# EasyEDA Pro project ProPrj_HSSM-Prog_2025-06-12.epro

# Schematic Schematic1
Board Name: Board1; Create Date: 2025-01-19; Page Name: P1; Project Name: HSSM-Prog; Schematic Name: Schematic1; Update Date: 2025-03-10; Company: EasyEDA.com; Page Size: A4; Version: V1.0
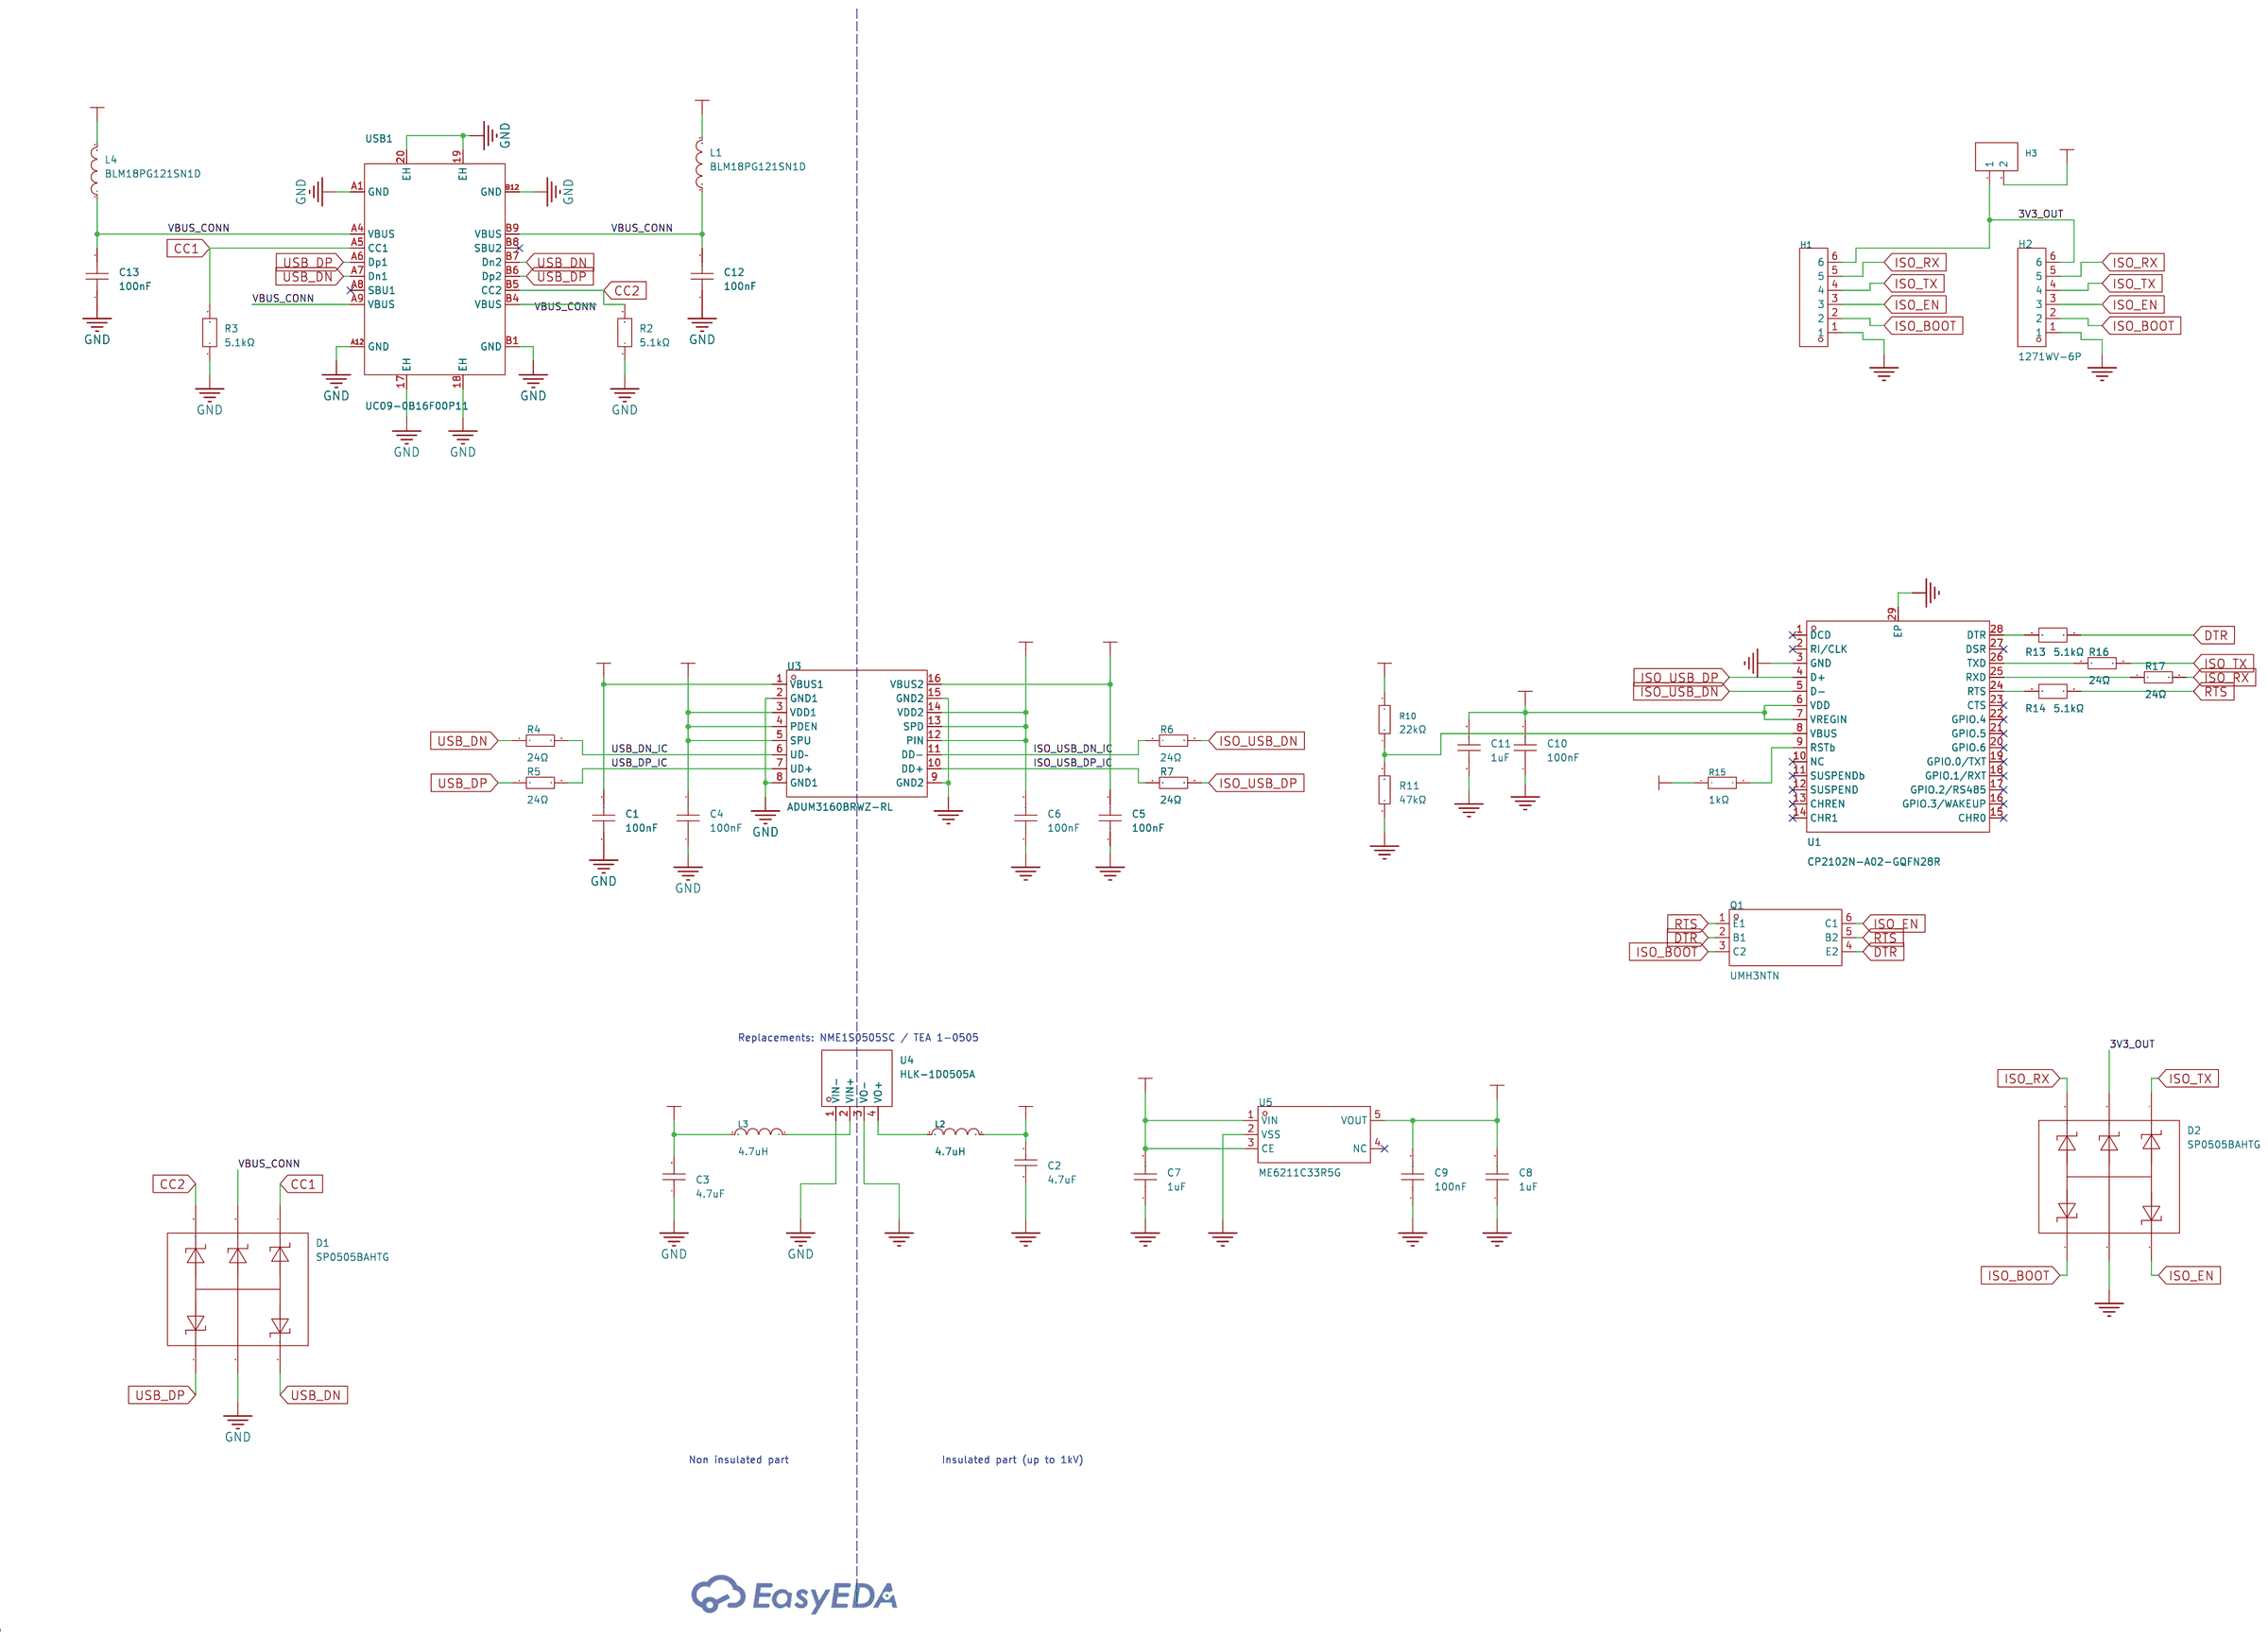
[diagram p0: schematic sheet]

## Parts
C1  100nF  [C0402]
C2  4.7uF  [C0603]
C3  4.7uF  [C0603]
C4  100nF  [C0402]
C5  100nF  [C0402]
C6  100nF  [C0402]
C7  1uF  [C0402]
C8  1uF  [C0402]
C9  100nF  [C0402]
C10  100nF  [C0402]
C11  1uF  [C0402]
C12  100nF  [C0402]
C13  100nF  [C0402]
D1  SP0505BAHTG  [SOT-23-6_L2.9-W1.6-P0.95-LS2.8-BR]
D2  SP0505BAHTG  [SOT-23-6_L2.9-W1.6-P0.95-LS2.8-BR]
H1  -  [HDR-TH_6P-P2.54-V-F]
H2  1271WV-6P  [HDR-TH_6P-P1.27-V-M-A]
H3  -  [HDR-TH_2P-P2.54-V-F]
L1  BLM18PG121SN1D  [L0603]
L2  4.7uH  [IND-SMD_L4.0-W4.0_SMNR4020]
L3  4.7uH  [IND-SMD_L4.0-W4.0_SMNR4020]
L4  BLM18PG121SN1D  [L0603]
Q1  UMH3NTN  [SOT-363_L2.0-W1.3-P0.65-LS2.1-TL]
R2  5.1kΩ  [R0402]
R3  5.1kΩ  [R0402]
R4  24Ω  [R0402]
R5  24Ω  [R0402]
R6  24Ω  [R0402]
R7  24Ω  [R0402]
R10  22kΩ  [R0402]
R11  47kΩ  [R0402]
R13  5.1kΩ  [R0402]
R14  5.1kΩ  [R0402]
R15  1kΩ  [R0402]
R16  24Ω  [R0402]
R17  24Ω  [R0402]
U1  CP2102N-A02-GQFN28R  [QFN-28_L5.0-W5.0-P0.50-TL-EP3.3]
U3  ADUM3160BRWZ-RL  [SOIC-16_L10.3-W7.5-P1.27-LS10.3-BL]
U4  HLK-1D0505A  [PWRM-TH_HLK-1DXXXX]
U5  ME6211C33R5G  [SOT-353_L2.1-W1.3-P0.65-LS2.3-BL]
USB1  UC09-0B16F00P11  [USB-C_UC09-0B16F00P11]

## Library data of the parts
C1 C4-C6 C9 C10 C12 C13 = CL05B104KO5NNNC: Capacitance: Tolerance:±10% Tolerance:±10% Voltage Rated: Temperature Coefficient:; LCSC Part Name: 100nF ±10% 16V; Supplier Part: C1525; Manufacturer: SAMSUNG(三星); Supplier Footprint: 0402; JLCPCB Part Class: Basic Part; Datasheet: https://atta.szlcsc.com/upload/public/pdf/source/20160218/1457707763339.pdf; Supplier: LCSC; Tolerance: ±10%
C2 C3 = CL10A475KO8NNNC: Capacitance: Tolerance:±10% Tolerance:±10% Voltage Rated: Temperature Coefficient:; LCSC Part Name: 4.7uF ±10% 16V; Supplier Part: C19666; Manufacturer: SAMSUNG(三星); Supplier Footprint: 0603; JLCPCB Part Class: Basic Part; Datasheet: https://atta.szlcsc.com/upload/public/pdf/source/20160218/1457707763339.pdf; Supplier: LCSC; Tolerance: ±10%
C7 C8 C11 = CL05A105KA5NQNC: Capacitance: Tolerance:±10% Tolerance:±10% Voltage Rated: Temperature Coefficient:; LCSC Part Name: 1uF ±10% 25V; Supplier Part: C52923; Manufacturer: SAMSUNG(三星); Supplier Footprint: 0402; JLCPCB Part Class: Basic Part; Datasheet: https://atta.szlcsc.com/upload/public/pdf/source/20160218/1457707763339.pdf; Supplier: LCSC; Tolerance: ±10%
D1 D2 = SP0505BAHTG: polarity:Unidirectional Reverse Stand-Off Voltage (Vrwm):5.5V@Max Maximum Clamping Voltage:8.5V Peak Pulse Current (Ipp)@10/1000us:- Peak Pulse Power Dissipation (Ppp)@10/1000us:- Breakdown Voltage:- Type:TVS; Supplier Part: C151299; Manufacturer: Littelfuse(美国力特); Supplier Footprint: SOT-23-6; JLCPCB Part Class: Extended Part; Datasheet: https://atta.szlcsc.com/upload/public/pdf/source/20181030/C316000_BE5E9B24FF2113DD8C1413334692F764.pdf; Supplier: LCSC; polarity: Unidirectional; Reverse Stand-Off Voltage (Vrwm): 5.5V@Max; Maximum Clamping Voltage: 8.5V; Type: TVS
H1 = HDR-F_2.54_1x6P: Supplier Footprint: Through
H2 = 1271WV-6P: Pin Structure:1x6P Pitch:1.27mm Circluar Pins/Square Pins:Square Pins Mounting Type:Straight Number of Rows:Plugin Number of Pins:6P Length of Mating Pin:4mm Insulation Height:1mm Length of End Connection Pin:2.2mm Contact Plating:Gold Operating Temperatu; LCSC Part Name: 1x6P 间距:1.27mm 方针 直插; Supplier Part: C7470082; Manufacturer: HanElectricity(瀚源); Supplier Footprint: 插件,P=1.27mm; JLCPCB Part Class: Extended Part; Datasheet: https://atta.szlcsc.com/upload/public/pdf/source/20230725/C20F4E8AA455A91903D6D6B88966FE30.pdf; Supplier: LCSC; Pin Structure: 1x6P; Pitch: 1.27mm; Circluar Pins/Square Pins: Square Pins; Mounting Type: Straight; Number of Rows: Plugin; Number of Pins: 6P; Length of Mating Pin: 4mm; Insulation Height: 1mm; Length of End Connection Pin: 2.2mm; Contact Plating: Gold; Operating Temperature Range: -40℃~+105℃
H3 = HDR-F_2.54_1x2P: Supplier Footprint: Through
L1 L4 = BLM18PG121SN1D_C14709: Impedance @ Frequency:120Ω@100MHz Tolerance:±25% Tolerance:±25% DC Resistance:50mΩ Current Rating:2A Circuits:1; LCSC Part Name: 单路 0603磁珠 阻抗120Ω@100MHz; Supplier Part: C14709; Manufacturer: muRata(村田); Supplier Footprint: 0603; JLCPCB Part Class: Extended Part; Datasheet: https://atta.szlcsc.com/upload/public/pdf/source/20130704/1457706621422.pdf; Supplier: LCSC; Impedance @ Frequency: 120Ω@100MHz; Tolerance: ±25%; DC Resistance: 50mΩ; Current Rating: 2A; Circuits: 1
L2 L3 = FNR4012S4R7MT: Inductance: Tolerance:±20% Tolerance:±20% Rated Current: Saturation Current (Isat):1.8A DC Resistance (DCR):163mΩ; LCSC Part Name: 4.7uH ±20% 1.8A; Supplier Part: C167781; Manufacturer: cjiang(长江微电); Supplier Footprint: SMD,4x4mm; JLCPCB Part Class: Extended Part; Datasheet: https://atta.szlcsc.com/upload/public/pdf/source/20190327/C167925_9EFF0AABC4CA629C2CC95961DBF7D39D.pdf; Supplier: LCSC; Tolerance: ±20%; Saturation Current (Isat): 1.8A; DC Resistance (DCR): 163mΩ
Q1 = UMH3NTN: Transistor Type:- Collector-Emitter Breakdown Voltage (Vceo):50V Collector Current (Ic):100mA Power Dissipation (Pd):150mW DC Current Gain (hFE@Ic,Vce):100@1mA,5V Input Resistor:6.11kΩ Operating Temperature:-25℃~+150℃ Operating Temperature:-25℃~+150℃; LCSC Part Name: 耐压:50V 电流:100mA; Supplier Part: C123008; Manufacturer: ROHM(罗姆); Supplier Footprint: SOT-363; JLCPCB Part Class: Extended Part; Datasheet: https://atta.szlcsc.com/upload/public/pdf/source/20170726/C123008_1501054486996843958.pdf; Supplier: LCSC; Collector-Emitter Breakdown Voltage (Vceo): 50V; Collector Current (Ic): 100mA; Power Dissipation (Pd): 150mW; DC Current Gain (hFE@Ic,Vce): 100@1mA,5V; Input Resistor: 6.11kΩ; Operating Temperature: -25℃~+150℃
R2 R3 R13 R14 = RCA025K1JLF: Resistance: Tolerance:±5% Tolerance:±5% Power(Watts):; LCSC Part Name: 5.1kΩ ±5% 62.5mW; Supplier Part: C22356228; Manufacturer: HKR(香港电阻); Supplier Footprint: 0402; JLCPCB Part Class: Extended Part; Datasheet: https://atta.szlcsc.com/upload/public/pdf/source/20240312/EB29F8B3E9AD4CE07E65E9956C47F4F5.pdf; Supplier: LCSC; Tolerance: ±5%
R4-R7 R16 R17 = AC0402FR-0724RL: Type:Thick Film Resistors Resistance: Tolerance:±1% Tolerance:±1% Power(Watts): Overload Voltage (Max): Temperature Coefficient:±100ppm/℃ Temperature Coefficient:±100ppm/℃ Operating Temperature Range:-55℃~+155℃ Operating Temperature Range:-55℃~+155℃; LCSC Part Name: 厚膜电阻 24Ω ±1% 62.5mW; Supplier Part: C226373; Manufacturer: YAGEO(国巨); Supplier Footprint: 0402; JLCPCB Part Class: Extended Part; Datasheet: https://atta.szlcsc.com/upload/public/pdf/source/20180927/C229861_4ABDC471507C1ED6AFB4BA66AFC8620A.pdf; Supplier: LCSC; Type: Thick Film Resistors; Tolerance: ±1%; Temperature Coefficient: ±100ppm/℃; Operating Temperature Range: -55℃~+155℃
R10 = 0402WGF2202TCE: Type:Thick Film Resistors Resistance:22kΩ Tolerance:±1% Tolerance:±1% Power(Watts): Overload Voltage (Max): Temperature Coefficient:±100ppm/℃ Temperature Coefficient:±100ppm/℃ Operating Temperature Range:-55℃~+155℃ Operating Temperature Range:-55℃~+155℃; LCSC Part Name: 22kΩ ±1% 62.5mW 厚膜电阻; Supplier Part: C25768; Manufacturer: UNI-ROYAL(厚声); Supplier Footprint: 0402; JLCPCB Part Class: Basic Part; Datasheet: https://atta.szlcsc.com/upload/public/pdf/source/20200306/C422600_1E6D84923E4A46A82E41ADD87F860B5C.pdf; Supplier: LCSC; Type: Thick Film Resistors; Tolerance: ±1%; Temperature Coefficient: ±100ppm/℃; Operating Temperature Range: -55℃~+155℃
R11 = 0402WGF4702TCE: Type:Thick Film Resistors Resistance:47kΩ Tolerance:±1% Tolerance:±1% Power(Watts): Overload Voltage (Max): Temperature Coefficient:±100ppm/℃ Temperature Coefficient:±100ppm/℃ Operating Temperature Range:-55℃~+155℃ Operating Temperature Range:-55℃~+155℃; LCSC Part Name: 47kΩ ±1% 62.5mW 厚膜电阻; Supplier Part: C25792; Manufacturer: UNI-ROYAL(厚声); Supplier Footprint: 0402; JLCPCB Part Class: Basic Part; Datasheet: https://atta.szlcsc.com/upload/public/pdf/source/20200306/C422600_1E6D84923E4A46A82E41ADD87F860B5C.pdf; Supplier: LCSC; Type: Thick Film Resistors; Tolerance: ±1%; Temperature Coefficient: ±100ppm/℃; Operating Temperature Range: -55℃~+155℃
R15 = 0402WGF1001TCE: Type:Thick Film Resistors Resistance:1kΩ Tolerance:±1% Tolerance:±1% Power(Watts): Overload Voltage (Max): Temperature Coefficient:±100ppm/℃ Temperature Coefficient:±100ppm/℃ Operating Temperature Range:-55℃~+155℃ Operating Temperature Range:-55℃~+155℃; LCSC Part Name: 1kΩ ±1% 62.5mW 厚膜电阻; Supplier Part: C11702; Manufacturer: UNI-ROYAL(厚声); Supplier Footprint: 0402; JLCPCB Part Class: Basic Part; Datasheet: https://atta.szlcsc.com/upload/public/pdf/source/20200306/C422600_1E6D84923E4A46A82E41ADD87F860B5C.pdf; Supplier: LCSC; Type: Thick Film Resistors; Tolerance: ±1%; Temperature Coefficient: ±100ppm/℃; Operating Temperature Range: -55℃~+155℃
U1 = CP2102N-A02-GQFN28R: Applications Function:USB to UART Protocol: Supply Voltage:3V~3.6V Supply Voltage:3V~3.6V Operating Temperature:-40℃~+85℃@(Ta) Operating Temperature:-40℃~+85℃@(Ta); Supplier Part: C964632; Manufacturer: SKYWORKS/SILICON LABS(芯科); Supplier Footprint: QFN-28-EP(5x5); JLCPCB Part Class: Extended Part; Datasheet: https://atta.szlcsc.com/upload/public/pdf/source/20201204/C964632_F2B790CC23A72455AEF523510305B30A.pdf; Supplier: LCSC; Applications Function: USB to UART; Supply Voltage: 3V~3.6V; Operating Temperature: -40℃~+85℃@(Ta)
U3 = ADUM3160BRWZ-RL: Supplier Part: C284149; Manufacturer: ADI(亚德诺); Supplier Footprint: SOIC-16-300mil; JLCPCB Part Class: Extended Part; Datasheet: https://atta.szlcsc.com/upload/public/pdf/source/20180910/C284149_11FBD45D63BF8FE73FB2D6895B6D3DA5.pdf; Supplier: LCSC
U4 = HLK-1D0505A: Supplier Part: C465411; Manufacturer: HI-LINK(海凌科); Supplier Footprint: 插件; JLCPCB Part Class: Extended Part; Datasheet: https://atta.szlcsc.com/upload/public/pdf/source/20191129/C465411_FF60358BC0D255D8109AA2E248627525.pdf; Supplier: LCSC
U5 = ME6211C33R5G: Output Type: Maximum Input Voltage:6.5V Output Voltage:3.3V Output Voltage:3.3V MAX Output Current:300mA Power Supply Rejection Ratio (PSRR):70dB@(1kHz) Dropout Voltage:260mV@(200mA) Output Polarity:Positive electrode Number of Outputs:1; LCSC Part Name: 输入6.5V 输出3.3V 300mA; Supplier Part: C235316; Manufacturer: MICRONE(南京微盟); Supplier Footprint: SOT-353; JLCPCB Part Class: Extended Part; Datasheet: https://atta.szlcsc.com/upload/public/pdf/source/20180801/C94042_8FDAFF138ADDED65E3D077205E9A8C17.pdf; Supplier: LCSC; Maximum Input Voltage: 6.5V; Output Voltage: 3.3V; MAX Output Current: 300mA; Power Supply Rejection Ratio (PSRR): 70dB@(1kHz); Dropout Voltage: 260mV@(200mA); Output Polarity: Positive electrode; Number of Outputs: 1
USB1 = UC09-0B16F00P11: Connector Type:Type-C Gender:Female Mounting Style:Horizontal attachment Number of Contacts:16P Number of Ports:1 Current Rating - Power (Max):3A Operating Temperature Range:-45℃~+85℃ Operating Temperature Range:-45℃~+85℃; LCSC Part Name: USB Type-C 母座 卧贴; Supplier Part: C36936538; Manufacturer: BXCONN(宝讯); Supplier Footprint: SMD; JLCPCB Part Class: Extended Part; Datasheet: https://atta.szlcsc.com/upload/public/pdf/source/20240731/B035EE1F909C9F58DBA2A5294768DB07.pdf; Supplier: LCSC; Connector Type: Type-C; Gender: Female; Mounting Style: Horizontal attachment; Number of Contacts: 16P; Number of Ports: 1; Current Rating - Power (Max): 3A; Operating Temperature Range: -45℃~+85℃

## Nets
3V3_OUT: D2.5 H1.6 H2.6 H3.1
GND: C1.1 C3.1 C4.1 C12.1 C13.1 D1.2 R2.1 R3.1 U3.2(GND1) U3.8(GND1) U4.1(VIN-) USB1.17(EH) USB1.18(EH) USB1.19(EH) USB1.20(EH) USB1.A1(GND) USB1.A12(GND) USB1.B1(GND) USB1.B12(GND)
VBUS: C1.2 C3.2 L1.2 L3.2 L4.2 U3.1(VBUS1)
VBUS_CONN: C12.2 C13.2 D1.5 L1.1 L4.1 USB1.A4(VBUS) USB1.A9(VBUS) USB1.B4(VBUS) USB1.B9(VBUS)
VDD: C4.2 U3.3(VDD1) U3.4(PDEN) U3.5(SPU)
CC1: D1.4 R3.2 USB1.A5(CC1)
CC2: D1.6 R2.2 USB1.B5(CC2)
DTR: Q1.2(B1) Q1.4(E2) R13.1
ISO3V3: C8.2 C9.2 C10.2 C11.2 H3.2 R15.1 U1.6(VDD) U1.7(VREGIN) U5.5(VOUT)
ISO_BOOT: D2.1 H1.2 H2.2 Q1.3(C2)
ISO_EN: D2.3 H1.3 H2.3 Q1.6(C1)
ISO_RX: D2.6 H1.5 H2.5 R17.2
ISO_TX: D2.4 H1.4 H2.4 R16.2
ISO_USB_DN: R6.2 U1.5(D-)
ISO_USB_DN_IC: R6.1 U3.11(DD-)
ISO_USB_DP: R7.2 U1.4(D+)
ISO_USB_DP_IC: R7.1 U3.10(DD+)
ISOGND: C2.1 C5.1 C6.1 C7.1 C8.1 C9.1 C10.1 C11.1 D2.2 H1.1 H2.1 R11.1 U1.3(GND) U1.29(EP) U3.9(GND2) U3.15(GND2) U4.3(VO-) U5.2(VSS)
ISOVBUS: C2.2 C5.2 C7.2 L2.1 R10.2 U3.16(VBUS2) U5.1(VIN) U5.3(CE)
ISOVDD: C6.2 U3.12(PIN) U3.13(SPD) U3.14(VDD2)
RTS: Q1.1(E1) Q1.5(B2) R14.1
USB_DN: D1.3 R4.1 USB1.A7(Dn1) USB1.B7(Dn2)
USB_DN_IC: R4.2 U3.6(UD–)
USB_DP: D1.1 R5.1 USB1.A6(Dp1) USB1.B6(Dp2)
USB_DP_IC: R5.2 U3.7(UD+)
$1N3529: L3.1 U4.2(VIN+)
$1N3534: L2.2 U4.4(VO+)
$1N4087: R15.2 U1.9(RSTb)
$1N4589: R10.1 R11.2 U1.8(VBUS)
$1N5325: R13.2 U1.28(DTR)
$1N5370: R14.2 U1.24(RTS)
$1N8654: R17.1 U1.25(RXD)
$1N8663: R16.1 U1.26(TXD)

Not connected (* = marked no-connect by the designer): U1 1(DCD)* 2(RI/CLK)* 10(NC)* 11(SUSPENDb)* 12(SUSPEND)* 13(CHREN)* 14(CHR1)* 15(CHR0)* 16(GPIO.3/WAKEUP)* 17(GPIO.2/RS485)* 18(GPIO.1/RXT)* 19(GPIO.0/TXT)* 20(GPIO.6)* 21(GPIO.5)* 22(GPIO.4)* 23(CTS)* 27(DSR)*; U5 4(NC)*; USB1 A8(SBU1)* B8(SBU2)*

## Notes on the sheet
- Replacements: NME1S0505SC / TEA 1-0505
- Non insulated part
- Insulated part (up to 1kV)

# Board PCB1
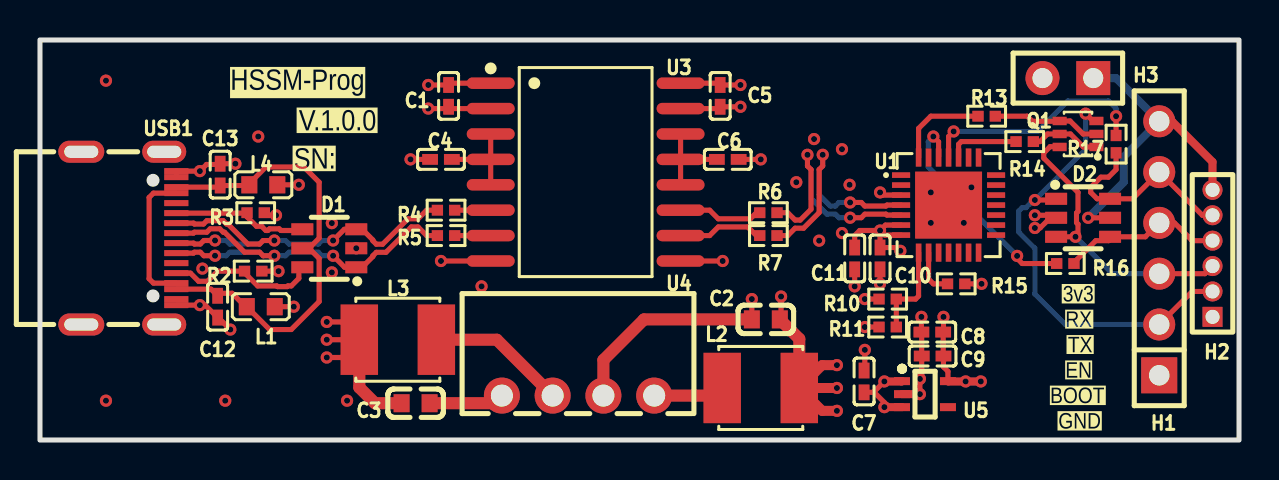
[diagram p1: board, top side]
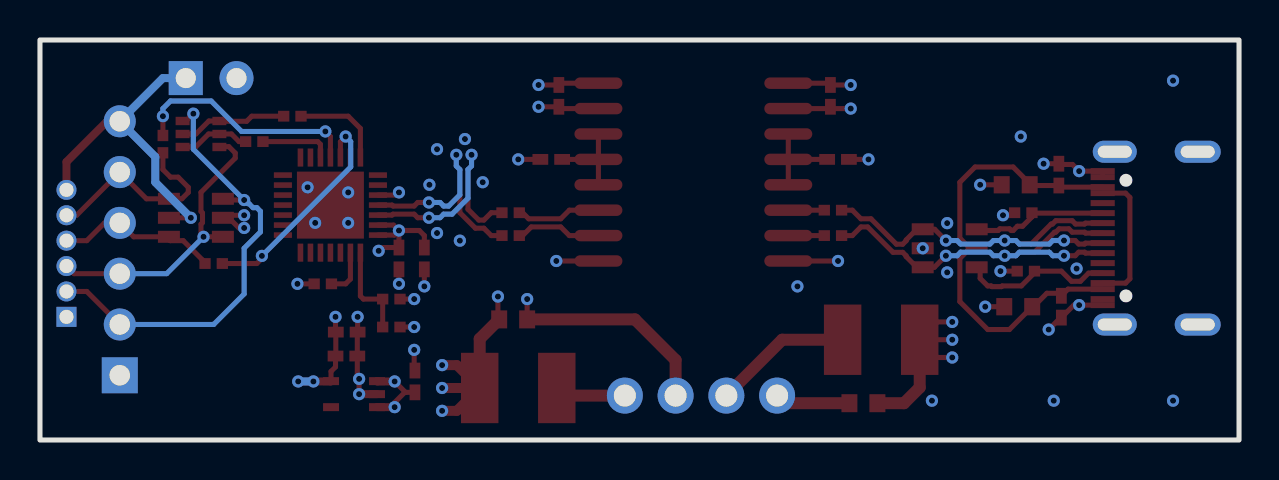
[diagram p2: board, bottom side, seen from below]

Outline 60 x 20 mm; copper layers: Top Layer, Inner1, Inner2, Bottom Layer. Coordinates in mm from the lower left corner of the outline.
Outline path: rectangle 0,20 60,0
Stack: Top Layer 0.035mm Outer layer thickness 1oz / Dielectric1 0.2104mm 7628 RC49% 8.6mil / Inner1 0.0152mm Inner layer thickness / Dielectric2 1.065mm 1.1mm H/HOZ Copper / Inner2 0.0152mm Inner layer thickness / Dielectric3 0.2104mm 7628 RC49% 8.6mil / Bottom Layer 0.035mm Outer layer thickness 1oz

## Design rules (mm)
net USB_DN: DP3
net USB_DP: DP3
net ISO_USB_DN: DP1
net ISO_USB_DP: DP1
net USB_DN_IC: DP2
net USB_DP_IC: DP2
net ISO_USB_DN_IC: DP4
net ISO_USB_DP_IC: DP4
template: User Custom Config
spacing copperThickness1oz (default): track to track 0.102, other pairs 0.152 to 0.3
spacing copperThickness2oz: track to track 0.203, other pairs 0.152 to 0.3
track width copperThickness1oz (default): min 0.127, default 0.254, max 2.54
track width copperThickness2oz: min 0.203, default 0.254, max 2.54
differential pair differentialPair (default): width min 0.127, default 0.254, max 2.54; gap min 0.152, default 0.152
via viaSize (default): diameter min 0.5, default 0.61, max 10; hole min 0.3, default 0.305, max 6.3

## Placement (name value [footprint] x y rotation side)
C1  100nF  [C0402]  20.45 17.21 90 top
C2  4.7uF  [C0603]  36.32 6.03 0 top
C3  4.7uF  [C0603]  18.8 1.84 180 top
C4  100nF  [C0402]  20.07 14.03 0 top
C5  100nF  [C0402]  34.04 17.21 90 top
C6  100nF  [C0402]  34.42 14.03 180 top
C7  1uF  [C0402]  41.24 2.93 270 top
C8  1uF  [C0402]  44.65 5.4 0 top
C9  100nF  [C0402]  44.67 4.2 0 top
C10  100nF  [C0402]  42.04 9.08 90 top
C11  1uF  [C0402]  40.77 9.08 90 top
C12  100nF  [C0402]  8.89 6.67 90 top
C13  100nF  [C0402]  9.02 13.27 270 top
D1  SP0505BAHTG  [SOT-23-6_L2.9-W1.6-P0.95-LS2.8-BR]  14.48 9.59 0 top
D2  SP0505BAHTG  [SOT-23-6_L2.9-W1.6-P0.95-LS2.8-BR]  52.2 11.11 180 top
H1  -  [HDR-TH_6P-P2.54-V-F]  56.01 9.59 90 top
H2  1271WV-6P  [HDR-TH_6P-P1.27-V-M-A]  58.67 9.33 90 top
H3  -  [HDR-TH_2P-P2.54-V-F]  51.43 18.09 180 top
L1  BLM18PG121SN1D  [L0603]  11.05 6.67 0 top
L2  4.7uH  [IND-SMD_L4.0-W4.0_SMNR4020]  36.07 2.6 0 top
L3  4.7uH  [IND-SMD_L4.0-W4.0_SMNR4020]  17.91 5.01 0 top
L4  BLM18PG121SN1D  [L0603]  11.18 12.76 0 top
Q1  UMH3NTN  [SOT-363_L2.0-W1.3-P0.65-LS2.1-TL]  51.94 15.3 180 top
R2  5.1kΩ  [R0402]  10.67 8.44 180 top
R3  5.1kΩ  [R0402]  10.8 11.36 180 top
R4  24Ω  [R0402]  20.32 11.49 0 top
R5  24Ω  [R0402]  20.32 10.22 0 top
R6  24Ω  [R0402]  36.45 11.36 0 top
R7  24Ω  [R0402]  36.45 10.22 0 top
R10  22kΩ  [R0402]  42.42 7.05 180 top
R11  47kΩ  [R0402]  42.42 5.65 0 top
R13  5.1kΩ  [R0402]  47.37 16.19 180 top
R14  5.1kΩ  [R0402]  49.28 14.92 180 top
R15  1kΩ  [R0402]  45.85 7.81 180 top
R16  24Ω  [R0402]  51.31 8.82 0 top
R17  24Ω  [R0402]  53.85 14.79 270 top
U1  CP2102N-A02-GQFN28R  [QFN-28_L5.0-W5.0-P0.50-TL-EP3.3]  45.47 11.75 0 top
U3  ADUM3160BRWZ-RL  [SOIC-16_L10.3-W7.5-P1.27-LS10.3-BL]  27.3 13.4 270 top
U4  HLK-1D0505A  [PWRM-TH_HLK-1DXXXX]  26.92 2.22 180 top
U5  ME6211C33R5G  [SOT-353_L2.1-W1.3-P0.65-LS2.3-BL]  44.28 2.29 270 top
USB1  UC09-0B16F00P11  [USB-C_UC09-0B16F00P11]  4.44 10.09 270 top

## Footprints (pads in the part's own frame, mm; a bottom-side part is the same pattern mirrored in y, then rotated)
C0402
  rect 0.79x0.54 smd: 1(-0.545,0) 2(0.545,0)
C0603
  rect 0.8x0.9 smd: 1(-0.7,0) 2(0.7,0)
HDR-TH_2P-P2.54-V-F
  rect 1.7x1.7 hole 1: 1(-1.27,0)
  round 1.7 hole 1: 2(1.27,0)
HDR-TH_6P-P1.27-V-M-A
  rect 1x1 hole 0.7: 1(-3.175,0)
  round 1 hole 0.7: 2(-1.905,0) 3(-0.635,0) 4(0.635,0) 5(1.905,0) 6(3.175,0)
HDR-TH_6P-P2.54-V-F
  rect 1.8x1.8 hole 1.02: 1(-6.35,0)
  round 1.6 hole 1.02: 2(-3.81,0) 3(-1.27,0) 4(1.27,0) 5(3.81,0) 6(6.35,0)
IND-SMD_L4.0-W4.0_SMNR4020
  rect 1.874x3.52 smd: 1(1.928,0) 2(-1.928,0)
L0603
  rect 0.8x0.864 smd: 1(-0.7,0) 2(0.7,0)
PWRM-TH_HLK-1DXXXX
  round 1.8 hole 1.1: 1(3.81,0) 2(1.27,0) 3(-1.27,0) 4(-3.81,0)
QFN-28_L5.0-W5.0-P0.50-TL-EP3.3
  rect 0.905x0.28 smd: 1(-2.377,1.5) 2(-2.377,1) 3(-2.377,0.5) 4(-2.377,0) 5(-2.377,-0.5) 6(-2.377,-1) 7(-2.377,-1.5) 15(2.377,-1.5) 16(2.377,-1) 17(2.377,-0.5) 18(2.377,0) 19(2.377,0.5) 20(2.377,1) 21(2.377,1.5)
  rect 0.28x0.905 smd: 8(-1.5,-2.377) 9(-1,-2.377) 10(-0.5,-2.377) 11(0,-2.377) 12(0.5,-2.377) 13(1,-2.377) 14(1.5,-2.377) 22(1.5,2.377) 23(1,2.377) 24(0.5,2.377) 25(0,2.377) 26(-0.5,2.377) 27(-1,2.377) 28(-1.5,2.377)
  rect 3.35x3.35 smd: 29(0,0)
R0402
  rect 0.566x0.54 smd: 1(-0.433,0) 2(0.433,0)
SOIC-16_L10.3-W7.5-P1.27-LS10.3-BL
  oval 0.574x2.401 smd: 1(-4.445,-4.75) 2(-3.175,-4.75) 3(-1.905,-4.75) 4(-0.635,-4.75) 5(0.635,-4.75) 6(1.905,-4.75) 7(3.175,-4.75) 8(4.445,-4.75) 9(4.445,4.75) 10(3.175,4.75) 11(1.905,4.75) 12(0.635,4.75) 13(-0.635,4.75) 14(-1.905,4.75) 15(-3.175,4.75) 16(-4.445,4.75)
SOT-23-6_L2.9-W1.6-P0.95-LS2.8-BR
  rect 1.1x0.6 smd: 1(1.35,-0.95) 2(1.35,0) 3(1.35,0.95) 4(-1.35,0.95) 5(-1.35,0) 6(-1.35,-0.95)
SOT-353_L2.1-W1.3-P0.65-LS2.3-BL
  rect 0.4x0.8 smd: 1(-0.65,-1.15) 2(0,-1.15) 3(0.65,-1.15) 4(0.65,1.15) 5(-0.65,1.15)
SOT-363_L2.0-W1.3-P0.65-LS2.1-TL
  rect 0.7x0.42 smd: 1(-0.92,0.65) 2(-0.92,0) 3(-0.92,-0.65) 4(0.92,-0.65) 5(0.92,0) 6(0.92,0.65)
USB-C_UC09-0B16F00P11
  oval 1.1x2.2 hole 0.6x1.7: 17(4.32,1.772) 20(-4.32,1.772)
  oval 1.1x2.3 hole 0.6x1.7: 18(4.32,-2.377) 19(-4.32,-2.377)
  rect 0.3x1.21 smd: A1(-3.35,2.377) A4(-2.55,2.377) A5(-1.25,2.377) A6(-0.25,2.377) A7(0.249,2.377) A8(1.25,2.377) A9(2.55,2.377) A12(3.35,2.377) B1(3.05,2.377) B4(2.249,2.377) B5(1.75,2.377) B6(0.75,2.377) B7(-0.75,2.377) B8(-1.75,2.377) B9(-2.25,2.377) B12(-3.05,2.377)

## Nets
As in the schematic.

Pads without a net: U1 1 2 10 11 12 13 14 15 16 17 18 19 20 21 22 23 27; U5 4; USB1 A8 B8

## Via types
v1: diameter 0.61, hole 0.305, Top Layer to Bottom Layer, 81 vias

## Routing (per net, layer and track width the routed paths; a pad name or vN(x,y) marks a point on that pad's centre or on a via; arc(x,y) is an arc through that point)
3V3_OUT: length 16.5
  Top Layer w0.254: D2.5 v1(52.45,11.11)
  Top Layer w0.4: H1.6 56.64,15.94 58.67,13.9 H2.6
  Bottom Layer w0.4: H3.1 53.85,18.09 H1.6 54.23,14.16 54.23,12.89 v1(52.45,11.11)
GND: length 18.5
  Top Layer w0.254: U3.2 20.54,16.57 C1.1 20.36,16.57 v1(19.43,16.57) ; R2.1 v1(11.94,8.44) ; 22.55,8.95 v1(20.07,8.95) ; v1(11.81,11.24) 11.36,11.24 R3.1 ; v1(9.78,13.81) C13.1 8.98,13.78 8.33,13.78 v1(8,13.44) USB1.A1 USB1.B12 ; C4.1 v1(18.54,14.03) ; v1(9.52,5.52) 8.93,6.12 C12.1 8.27,6.74 v1(8,6.74) USB1.A12
  Top Layer w0.6: C3.1 22.73,1.84 U4.1
  vias: v1(3.3,17.97) v1(3.3,1.97) v1(8.13,8.57) v1(9.27,1.97) v1(10.92,15.17) v1(14.61,10.84) v1(14.61,8.38) v1(15.37,1.97) v1(15.83,9.59) v1(22.1,7.68)
VBUS: length 15.3
  Top Layer w0.254: L3.2 15.09,4.12 v1(14.35,4.12) ; L3.2 15.09,5.9 v1(14.35,5.9) ; L3.2 v1(14.35,5.01) ; v1(19.43,17.75) C1.2 20.54,17.84 U3.1 ; L1.2 v1(12.7,6.67) ; 12.26,12.76 v1(12.95,12.76)
  Top Layer w0.6: C3.2 16.76,1.84 15.98,2.62 L3.2
VBUS_CONN: length 30.3
  Top Layer w0.254: D1.5 13.46,9.59 ; 13.46,9.59 13.97,9.08 13.97,6.92 12.57,5.52 11.49,5.52 L1.1 10.22,6.79 10.16,6.79 9.61,7.34 9.02,7.34 C12.2 8.56,7.54 USB1.A9 ; 13.46,9.59 13.97,10.09 13.97,12.89 13.21,13.65 11.3,13.65 10.48,12.82 L4.1 10.44,12.72 C13.2 8.94,12.64 USB1.A4 ; USB1.B4 5.68,7.84 5.46,8.06 5.46,12.13 5.68,12.34 USB1.B9
VDD: length 4.5
  Top Layer w0.254: U3.4 C4.2 ; U3.4 U3.5 ; U3.4 U3.3
CC1: length 6.7
  Top Layer w0.254: USB1.A5 10.22,11.34 ; D1.4 13.07,10.48 12.05,10.48 11.97,10.56 11.49,10.56 11.4,10.48 11.3,10.48 11.09,10.69 10.83,10.69 10.36,11.16 R3.2
CC2: length 7.4
  Top Layer w0.254: R2.2 8.89,8.44 8.38,7.94 7.94,7.94 7.53,8.34 USB1.B5 ; D1.6 12.95,8.46 12.95,8.08 12.58,7.7 12.41,7.7 12.37,7.67 11.89,7.67 11.85,7.7 10.89,7.7 10.34,8.25
DTR: length 5.4
  Top Layer w0.254: R13.1 49.4,16.19 49.66,15.94 51.01,15.94 51.02,15.95 51.55,15.95 52.2,15.3 Q1.2
ISO3V3: length 12.7
  Top Layer w0.254: C9.2 45.2,4.21 C8.2 45.21,5.41 v1(45.21,6.16) ; v1(43.05,9.46) 42.89,9.62 C10.2 v1(42.04,10.48) ; v1(42.04,10.48) 41.02,10.48 40.77,10.22 C11.2 ; v1(42.04,10.48) 42.27,10.25 U1.7 ; v1(42.04,10.48) 42.31,10.75 U1.6 ; R15.1 v1(47.12,7.81) ; U5.5 45.43,3.43 45.21,3.65 45.21,4.07
  Top Layer w0.4: v1(47.08,2.93) v1(46.32,2.93) 45.45,2.93 U5.5
  Bottom Layer w0.4: v1(47.08,2.93) v1(46.32,2.93)
ISO_BOOT: length 22.9
  Top Layer w0.254: H2.2 57.66,7.43 H1.2 ; D2.1 50.79,12 v1(49.78,12) ; Q1.3 52.69,15.95 v1(52.32,16.32)
  Bottom Layer w0.254: H1.2 51.31,5.78 49.78,7.3 49.78,9.59 48.97,10.4 48.97,11.44 49.15,11.62 49.34,11.62 49.54,11.82 49.61,11.82 v1(49.78,12) 52.32,14.54 v1(52.32,16.32)
ISO_EN: length 14.7
  Top Layer w0.254: D2.3 v1(51.82,10.16) 51.94,10.29 51.94,10.79 51.87,10.87 51.87,11.35 51.94,11.43 51.94,12.38 50.23,14.09 50.23,14.35 50.55,14.67 51.01,14.67 51.02,14.65 ; H1.3 58.29,8.32 H2.3
  Bottom Layer w0.254: H1.3 53.66,8.32 v1(51.82,10.16)
ISO_RX: length 10.4
  Top Layer w0.254: H2.5 58.17,11.24 H1.5 54.67,12.06 D2.6 52.9,12.06 52.58,12.38 52.58,12.63 53.09,13.14 53.47,13.14 53.85,13.52 R17.2
ISO_TX: length 8.1
  Top Layer w0.254: 51.87,8.95 51.87,9 52.83,9.97 53.48,9.97 53.55,10.03 D2.4 55.31,10.16 H1.4 56.77,10.86 57.66,9.97 H2.4
ISO_USB_DN: length 12.1
  Top Layer w0.254: v1(38.4,14.26) 38.4,13.7 38.58,13.52 38.58,11.54 38.04,11 37.79,11 37.42,11.36 R6.2 ; U1.5 42.38,11.25 42.33,11.29 41.27,11.29 41.1,11.11 v1(40.54,11.11)
  Bottom Layer w0.254: v1(38.4,14.26) 38.4,13.7 38.58,13.52 38.58,12.09 39.38,11.29 39.8,11.29 39.98,11.11 v1(40.54,11.11)
ISO_USB_DN_IC: length 4.3
  Top Layer w0.254: U3.11 33.51,11.49 33.94,11.06 35.54,11.06 35.85,11.36 R6.1
ISO_USB_DP: length 12.1
  Top Layer w0.254: U1.4 42.38,11.75 42.33,11.7 41.27,11.7 41.1,11.88 v1(40.54,11.88) ; v1(39.17,14.26) 39.17,13.7 38.99,13.52 38.99,11.37 38.21,10.59 37.79,10.59 37.42,10.22 R7.2
  Bottom Layer w0.254: v1(40.54,11.88) 39.98,11.88 39.8,11.7 39.55,11.7 38.99,12.26 38.99,13.52 39.17,13.7 v1(39.17,14.26)
ISO_USB_DP_IC: length 4.3
  Top Layer w0.254: R7.1 35.85,10.22 35.42,10.65 33.94,10.65 33.51,10.22 U3.10
ISOGND: length 28.8
  Top Layer w0.254: C7.1 41.27,3.51 v1(41.27,4.51) ; R11.1 v1(41.27,5.65) ; v1(44.03,2.29) v1(44.03,3.06) 44.12,3.15 44.12,4.07 ; 32.06,8.95 v1(34.16,8.95) ; v1(49.78,11.24) 50.72,11.24 D2.2 50.55,11.11 50.04,10.6 v1(49.78,10.6) ; C2.1 v1(35.62,7.05) ; C6.1 v1(36.07,14.03) ; v1(35.05,16.66) C5.1 33.95,16.57 U3.15 ; U1.3 42.17,12.25 v1(42.04,12.38) ; C9.1 44.12,5.38 C8.1 v1(44.11,6.16) ; C11.1 v1(40.77,7.68) ; C10.1 v1(42.04,7.81)
  Top Layer w0.4: U5.2 v1(44.03,2.29)
  Top Layer w0.6: U4.3 28.19,4 30.23,6.03 C2.1
  vias: v1(37.85,12.89) v1(38.73,15.05) v1(38.99,9.97) v1(40.13,14.54) v1(40.13,10.35) v1(40.51,12.76) v1(44.58,12.38) v1(44.58,10.86) v1(46.23,10.86) v1(46.61,12.63)
ISOVBUS: length 19.3
  Top Layer w0.254: C2.2 37.08,6.09 v1(37.08,7.17) ; R10.2 v1(41.27,7.05) ; 41.71,2.38 v1(42.25,2.93) ; 41.71,2.38 41.24,2.38 ; 41.71,2.38 41.74,2.38 42.25,1.87 v1(42.25,1.64) ; U3.16 33.95,17.84 C5.2 v1(35.05,17.75)
  Top Layer w0.4: U5.3 v1(42.25,1.64) ; U5.1 43.12,2.93 v1(42.25,2.93)
  Top Layer w0.5: L2.1 v1(39.88,2.6) ; L2.1 39.14,3.74 v1(39.88,3.74) ; L2.1 39.14,1.46 v1(39.88,1.46)
  Top Layer w0.6: L2.1 38,5.06 C2.2
ISOVDD: length 4.5
  Top Layer w0.254: 34.04,13.99 34,14.03 U3.13 ; U3.14 U3.13 ; U3.13 U3.12
RTS: length 3.6
  Top Layer w0.254: R14.1 50.04,14.92 50.42,15.3 51.56,15.3 52.21,14.65 Q1.1
USB_DN: length 20.3
  Top Layer w0.254: v1(11.73,9.97) 11.17,9.97 10.99,9.8 10.4,9.8 9.4,10.8 9.34,10.8 9.17,10.97 8.35,10.97 8.18,10.8 7.73,10.8 7.68,10.84 USB1.B7 ; v1(14.67,9.97) 15.23,10.54 D1.3 16.12,10.54 16.66,10 16.66,9.96 16.83,9.79 17.14,9.79 18.42,11.06 18.92,11.06 19.35,11.49 19.89,11.49 ; USB1.A7 7.68,9.84 7.73,9.8 8.02,9.8 8.2,9.98 v1(8.76,9.98)
  Bottom Layer w0.254: v1(14.67,9.97) 14.11,9.97 13.93,9.8 12.46,9.8 12.29,9.97 v1(11.73,9.97) 11.17,9.97 10.99,9.8 9.5,9.8 9.32,9.98 v1(8.76,9.98)
USB_DN_IC: length 1.8
  Top Layer w0.254: R4.2 U3.6
USB_DP: length 20.3
  Top Layer w0.254: v1(14.67,9.21) 15.24,8.64 D1.1 16.12,8.64 16.66,9.17 16.66,9.21 16.83,9.38 17.31,9.38 18.58,10.65 18.92,10.65 19.35,10.22 19.89,10.22 ; USB1.A6 7.68,10.34 7.73,10.39 8.35,10.39 8.52,10.56 9,10.56 9.17,10.39 9.23,10.39 10.23,9.39 10.99,9.39 11.17,9.21 v1(11.73,9.21) ; USB1.B6 7.68,9.34 7.73,9.39 8.02,9.39 8.2,9.21 v1(8.76,9.21)
  Bottom Layer w0.254: v1(8.76,9.21) 9.32,9.21 9.5,9.39 10.99,9.39 11.17,9.21 v1(11.73,9.21) 12.29,9.21 12.46,9.39 13.93,9.39 14.11,9.21 v1(14.67,9.21)
USB_DP_IC: length 1.8
  Top Layer w0.254: R5.2 U3.7
$1N3529: length 7
  Top Layer w0.6: U4.2 22.86,5.01 L3.1
$1N3534: length 3.6
  Top Layer w0.6: U4.4 33.76,2.22 L2.2
$1N4087: length 2.4
  Top Layer w0.254: R15.2 44.7,7.81 44.47,8.05 U1.9
$1N4589: length 4.7
  Top Layer w0.254: R11.2 R10.1 43.81,7.05 43.97,7.2 U1.8
$1N5325: length 4.7
  Top Layer w0.254: U1.28 43.97,15.58 44.58,16.19 R13.2
$1N5370: length 3.6
  Top Layer w0.254: R14.2 46.1,14.92 45.97,14.78 U1.24
$1N8654: length 11.7
  Top Layer w0.254: U1.25 45.47,15.17 v1(45.72,15.43) ; v1(53.85,16.19) R17.1
  Bottom Layer w0.254: v1(45.72,15.43) 49.91,15.43 51.43,16.95 53.47,16.95 53.85,16.57 v1(53.85,16.19)
$1N8663: length 11.5
  Top Layer w0.254: 51,8.95 50.87,8.82 49.15,8.82 48.89,9.08 v1(48.89,9.2) ; U1.26 44.97,14.91 v1(44.7,15.17)
  Bottom Layer w0.254: v1(48.89,9.2) 44.45,13.65 44.45,14.92 v1(44.7,15.17)

## Copper pours and planes (outline as drawn; the poured copper is in the pictures)
GND on Inner1: 0,20 24.89,20 24.89,0.06 24.77,-0.07 0.13,-0.07 0,0.06
GND on Inner2: 7.37,11.62 16.26,11.62 16.26,7.81 7.37,7.81
VBUS on Inner2: 0,20 24.81,20 24.81,0 0,0
ISO3V3 on Inner2: 37.6,6.4 38.48,5.52 44.7,5.52 44.83,5.4 44.83,0 60,0 60,20 37.72,20 37.72,15.42 42.45,15.42 42.45,11.31 40.69,9.56 37.6,9.56
ISOGND on Inner1: 29.97,20 29.97,-0.06 59.94,-0.06 60,0 60,20
ISOGND on Inner2: 42.45,15.43 37.46,15.43 37.46,9.62 40.77,9.62 42.38,11.24 42.38,11.25 42.45,11.31
ISOVBUS on Inner2: 30,0 44.64,0 44.7,-0.07 44.7,7.43 38.86,7.43 37.34,8.95 37.34,20 29.97,20 29.97,2.67

## Text on the board
Top Silkscreen Layer: BOOT | GND | 3v3 | RX | EN | TX | HSSM-Prog | SN: | V.1.0.0
